# Altium project controle de luminosidade com ESP32.PrjPcb
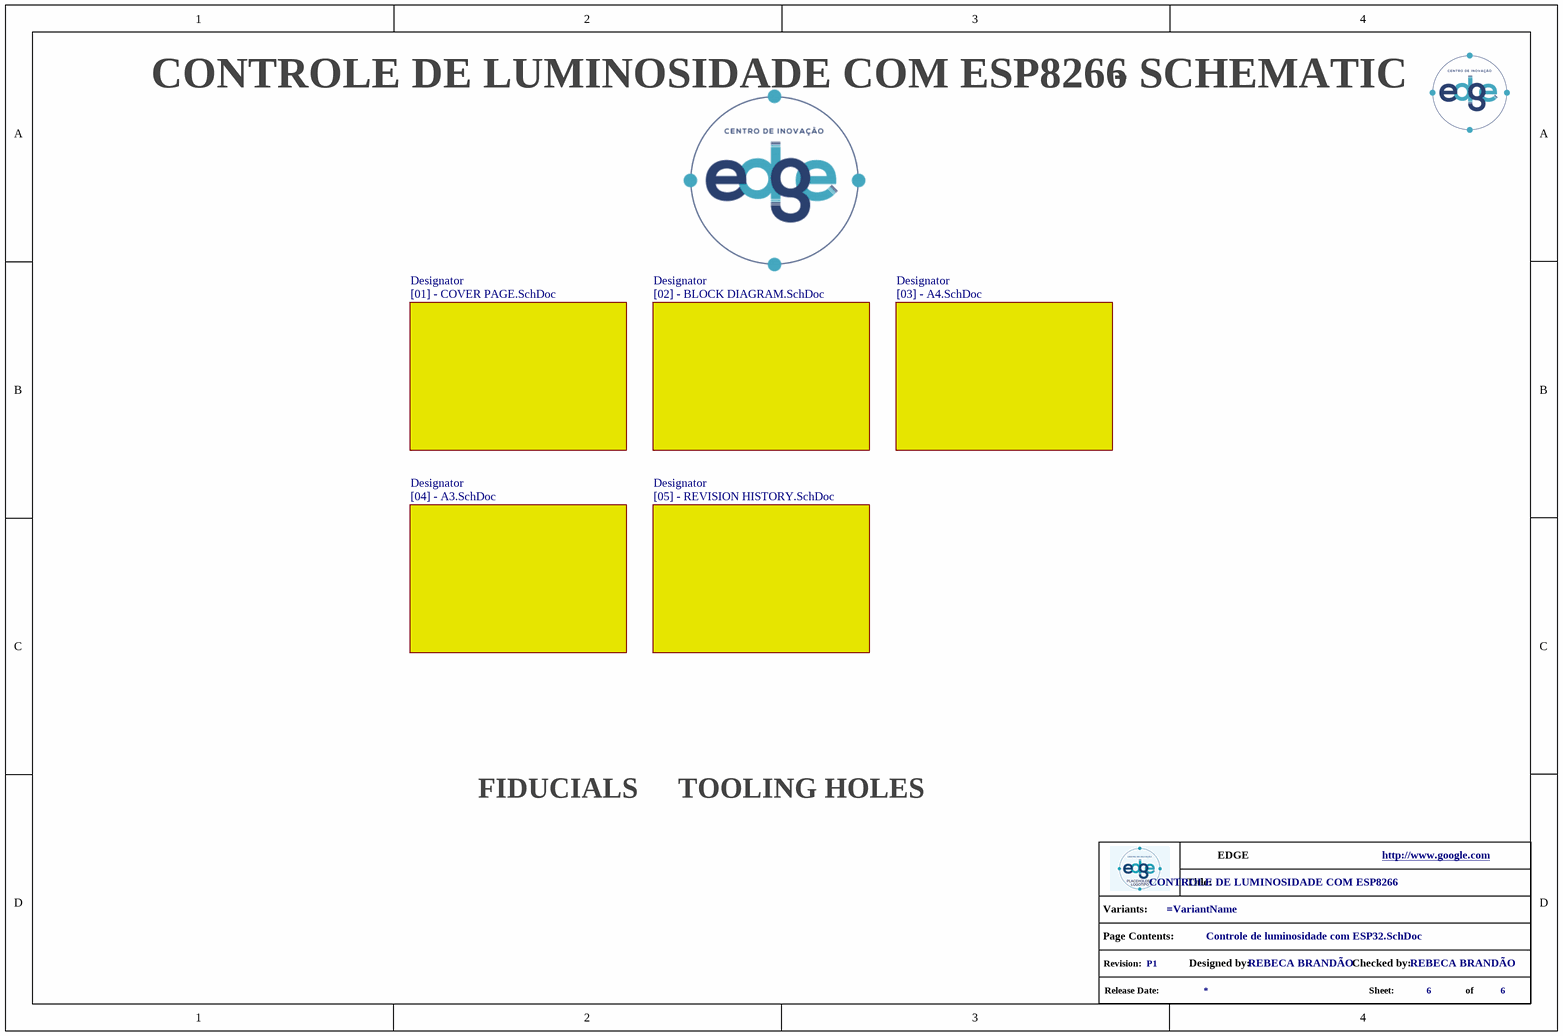
[diagram p0: Controle de luminosidade com ESP32.SchDoc]
CheckedProject: REBECA BRANDÃO; Company: EDGE; DesignedProject: REBECA BRANDÃO; TitleProject: CONTROLE DE LUMINOSIDADE COM ESP8266; VersionRevision: P1; Website: http://www.google.com
5 sheets, 42 parts. Net scope: global (net labels, ports and power ports of the same name join across sheets).
Board file: controle de luminosidade com ESP32.PcbDoc
Sheets:
  Controle de luminosidade com ESP32.SchDoc
    Designator = [02] - BLOCK DIAGRAM.SchDoc
    Designator = [03] - A4.SchDoc
    Designator = [04] - A3.SchDoc
    Designator = [05] - REVISION HISTORY.SchDoc

## Sheet Controle de luminosidade com ESP32.SchDoc
size A4; DocumentNumber: 6; SheetNumber: 6; SheetTotal: 6

### Parts
(Parts that share a designator on the sheet are numbered #1, #2 ... from top to bottom, then left to right.)
*?#1  info_project  (value not drawn)  (graphical)

### Sub-sheets
Designator = [02] - BLOCK DIAGRAM.SchDoc: no entries
Designator = [03] - A4.SchDoc: no entries
Designator = [01] - COVER PAGE.SchDoc (file not in this document): no entries
Designator = [04] - A3.SchDoc: no entries
Designator = [05] - REVISION HISTORY.SchDoc: no entries

### Notes on the sheet
- - SCHEMATIC
- FIDUCIALS
- TOOLING HOLES
- (in symbol info_project) Title:; Variants:; Page Contents:; Revision:; Designed by:; Checked by:; Release Date:; Sheet:; of

## Sheet [02] - BLOCK DIAGRAM.SchDoc
size A2; DocumentNumber: 2; SheetNumber: 2; SheetTotal: 6; PageSetup: Record=PageOptions|CenterHorizontal=True|CenterVertical=True|PrintScale=0.52|XCorrection=1.00|YCorrection=1.00|PrintKind=1|BorderSize=5000000|LeftOffset=0|BottomOffset=0|Orientation=2|PaperLength=1000|PaperWidth=1000|Scale=100|PaperSource=4|PrintQuality=600|MediaType=1|DitherType=10|PrintScaleMode=1|PaperKind=A4|PaperIndex=9
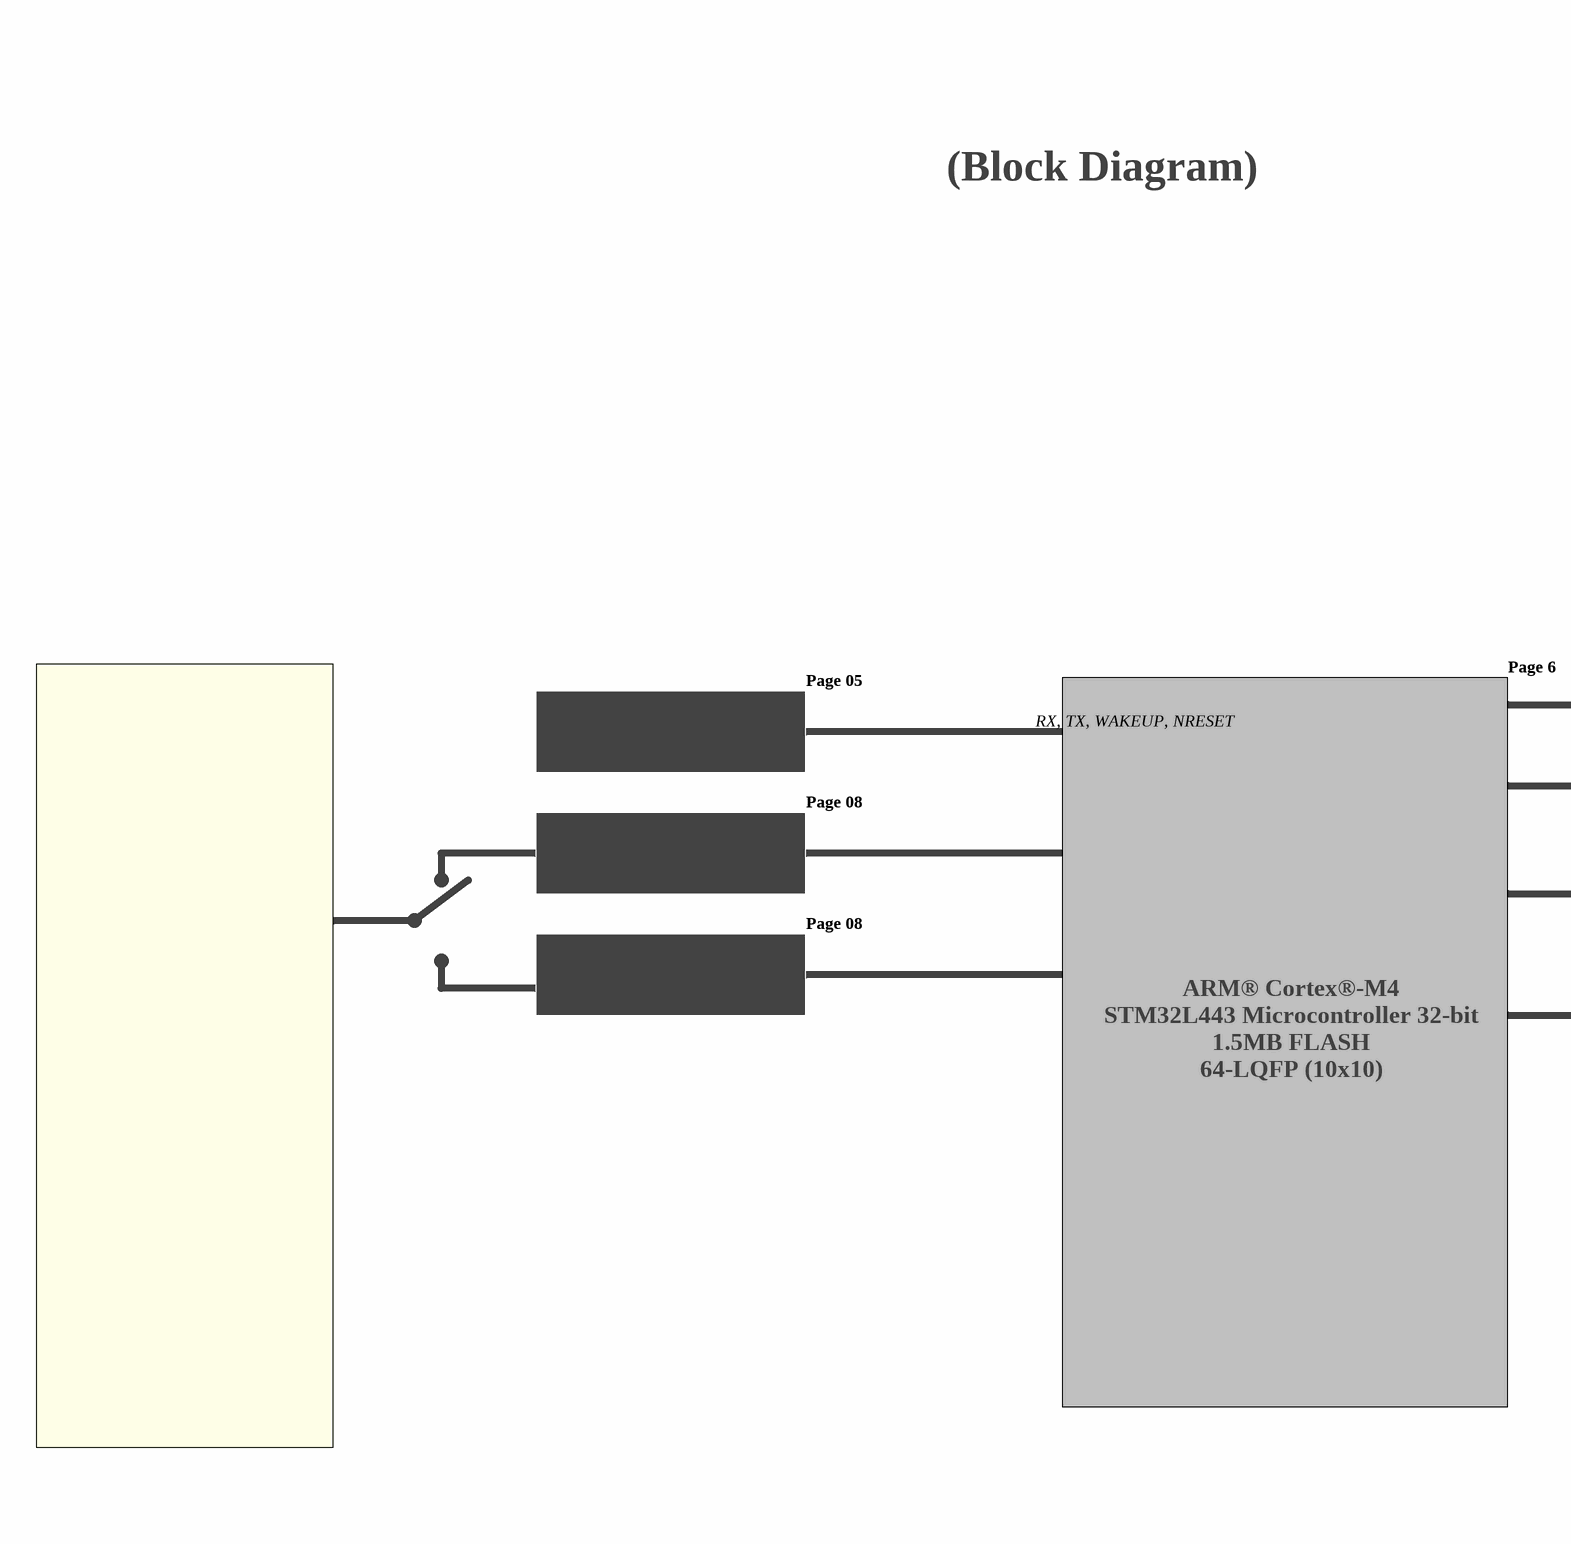
[diagram p1: [02] - BLOCK DIAGRAM.SchDoc, left]
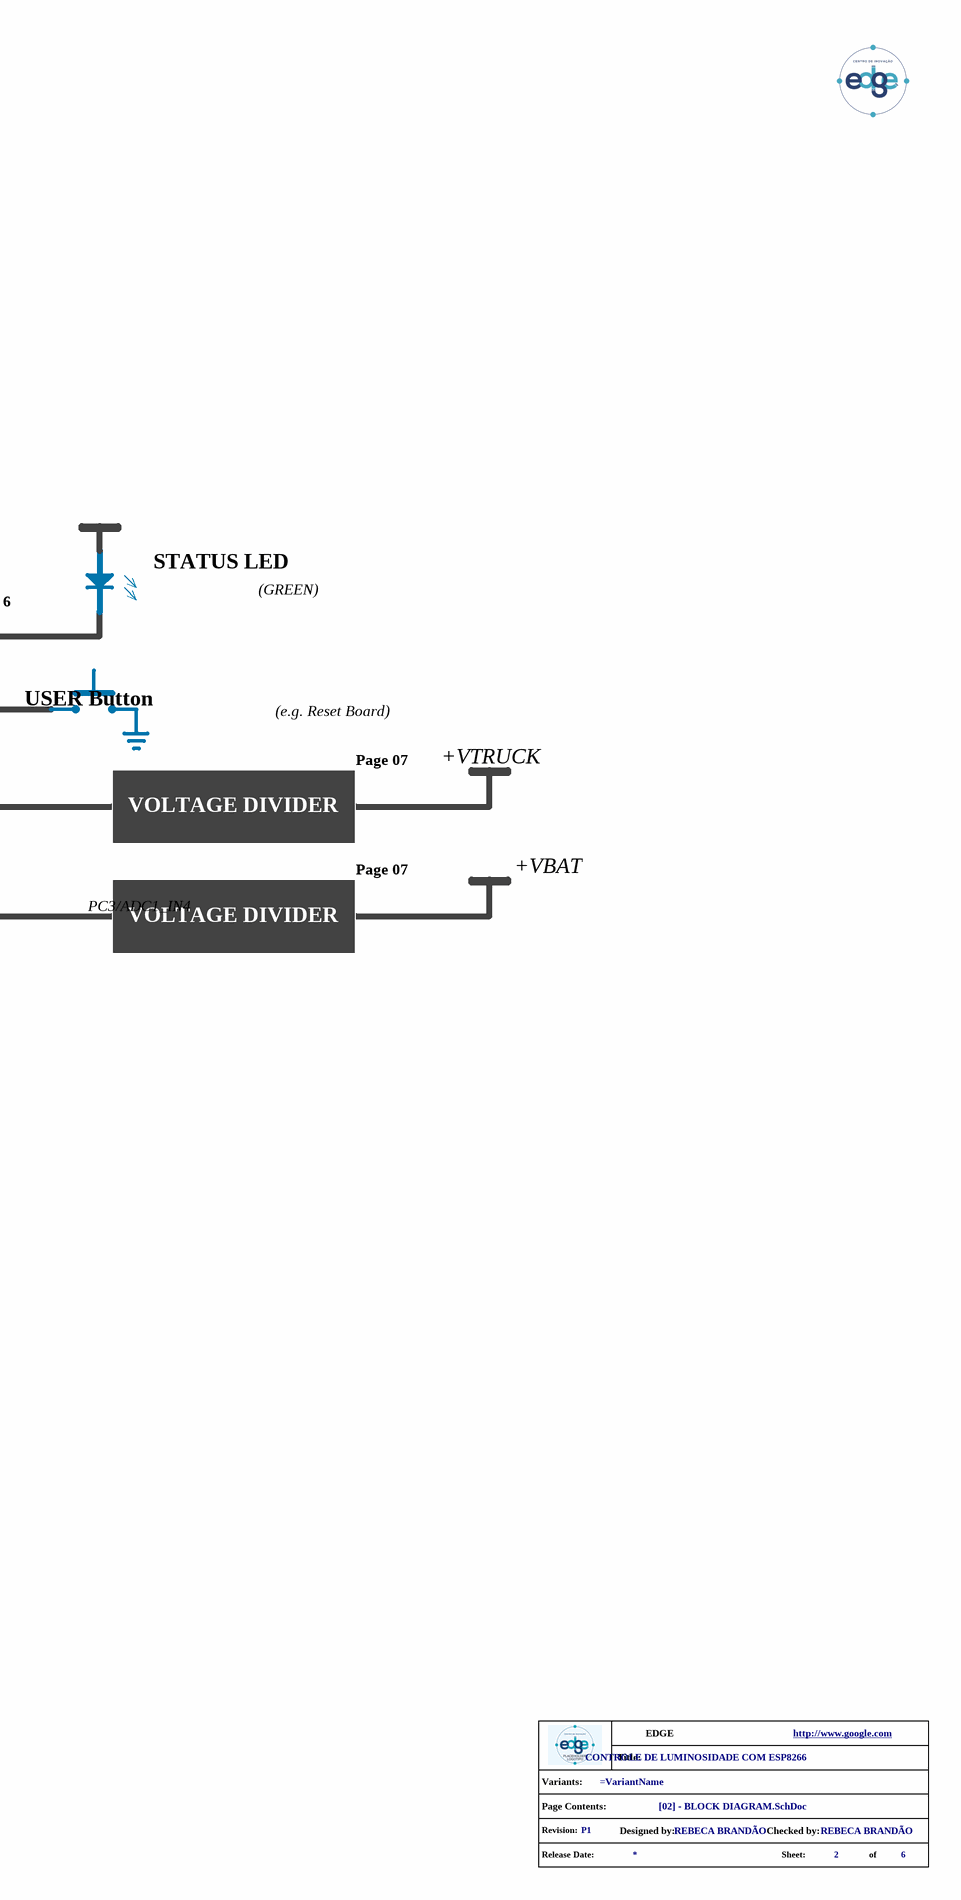
[diagram p2: [02] - BLOCK DIAGRAM.SchDoc, right]

### Parts
(Parts that share a designator on the sheet are numbered #1, #2 ... from top to bottom, then left to right.)
*?#2  info_project  (value not drawn)  (graphical)

### Notes on the sheet
- (Block Diagram)
- STATUS LED
- Page 05
- Page 6
- (GREEN)
- RX, TX, WAKEUP, NRESET
- USER Button
- Page 08
- (e.g. Reset Board)
- Page 07
- +VTRUCK
- VOLTAGE DIVIDER
- ARM® Cortex®-M4
- +VBAT
- STM32L443 Microcontroller 32-bit
- 1.5MB FLASH
- PC3/ADC1_IN4
- 64-LQFP (10x10)
- (in symbol info_project) Title:; Variants:; Page Contents:; Revision:; Designed by:; Checked by:; Release Date:; Sheet:; of

## Sheet [03] - A4.SchDoc
size A4; DocumentNumber: 3; SheetNumber: 3; SheetTotal: 6
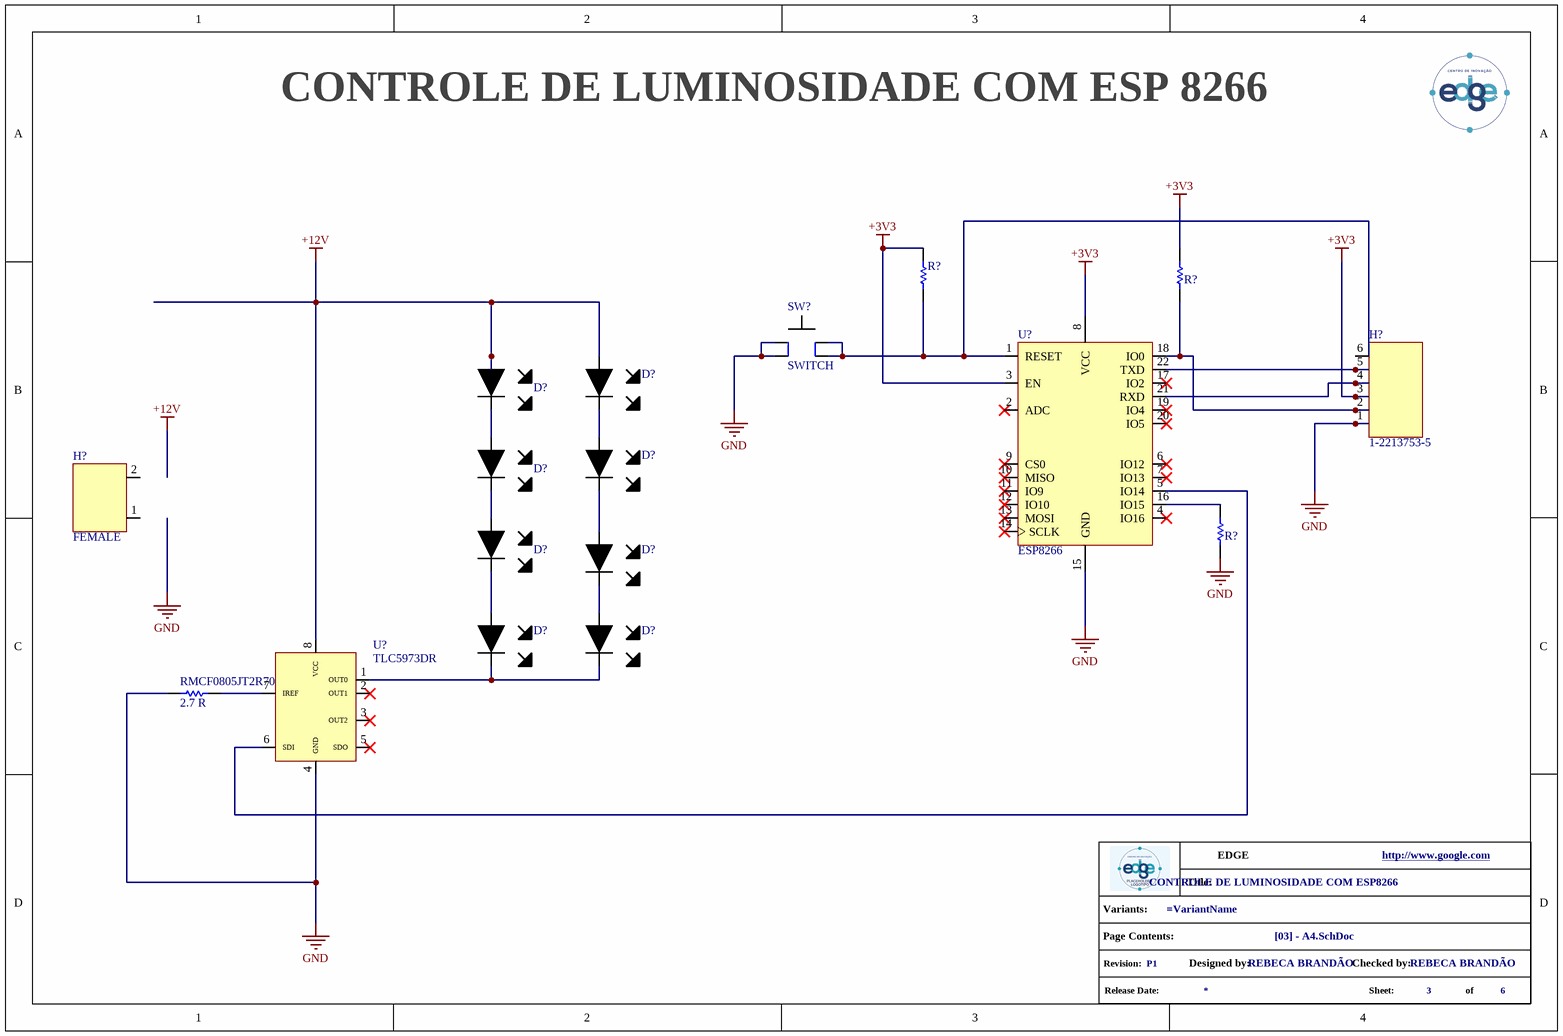
[diagram p3: [03] - A4.SchDoc]

### Parts
(Parts that share a designator on the sheet are numbered #1, #2 ... from top to bottom, then left to right.)
*?#3  info_project  (value not drawn)  (graphical)
D?#1  WHITE_LED  [WHITE_LED]  (value not drawn)
D?#2  WHITE_LED  [WHITE_LED]  (value not drawn)
D?#3  WHITE_LED  [WHITE_LED]  (value not drawn)
D?#4  WHITE_LED  [WHITE_LED]  (value not drawn)
D?#5  WHITE_LED  [WHITE_LED]  (value not drawn)
D?#6  WHITE_LED  [WHITE_LED]  (value not drawn)
D?#7  WHITE_LED  [WHITE_LED]  (value not drawn)
D?#8  WHITE_LED  [WHITE_LED]  (value not drawn)
H?#1  1-2213753-5
H?#2  FEMALE
R?#1  RESISTOR CFR-25JB-52-4K7  [R0805]  (value not drawn)
R?#2  CFR-25JB-52-10K  [R0603]  (value not drawn)
R?#3  CFR-25JB-52-10K  [R0603]  (value not drawn)
RMCF0805JT2R70  2.7 R  [R0805]
SW?#1  SWITCH
U?#1  ESP8266  [XCVR_ESP8266-12E/ESP-12E]
U?#2  TLC5973DR  [TLC5973]

### Nets
+3V3: H?#1.3 R?#1.2 R?#2.2 U?#1.3(EN) U?#1.8(VCC)
+12V: D?#1.1 D?#2.1 U?#2.8(VCC)
GND: H?#1.1 R?#3.1 RMCF0805JT2R70.1 SW?#1.SW1 U?#1.15(GND) U?#2.4(GND)
NetD?#1_2: D?#1.2 D?#3.1
NetD?#2_2: D?#2.2 D?#4.1
NetD?#3_2: D?#3.2 D?#5.1
NetD?#4_2: D?#4.2 D?#6.1
NetD?#5_2: D?#5.2 D?#7.1
NetD?#6_2: D?#6.2 D?#8.1
NetD?#7_2: D?#7.2 D?#8.2 U?#2.1(OUT0)
NetH?#1_2: H?#1.2 R?#2.1 U?#1.18(IO0)
NetH?#1_4: H?#1.4 U?#1.21(RXD)
NetH?#1_5: H?#1.5 U?#1.22(TXD)
NetR?#1_1: R?#1.1 SW?#1.SW1 U?#1.1(RESET)
NetR?#3_2: R?#3.2 U?#1.16(IO15)
NetRMCF0805JT2R70_2: RMCF0805JT2R70.2 U?#2.7(IREF)
NetU?#1_5: U?#1.5(IO14) U?#2.6(SDI)

Not connected (* = marked no-connect by the designer): H?#1 6; H?#2 1(__1) 2(_2); U?#1 2(ADC)* 4(IO16)* 6(IO12)* 7(IO13)* 9(CS0)* 10(MISO)* 11(IO9)* 12(IO10)* 13(MOSI)* 14(SCLK)* 17(IO2)* 19(IO4)* 20(IO5)*; U?#2 2(OUT1)* 3(OUT2)* 5(SDO)*

### Notes on the sheet
- CONTROLE DE LUMINOSIDADE COM ESP 8266
- (in symbol info_project) Title:; Variants:; Page Contents:; Revision:; Designed by:; Checked by:; Release Date:; Sheet:; of

### Library data of the parts
D?#1-D?#8 = WHITE_LED: LED - WHITE CLEAR T-1 3/4 T/H; Supplier 1: Digi-Key; Supplier Part Number 1: 492-2209-1-ND
H?#1 = 1-2213753-5: CONN - HEADER 6 pins; Manufacturer 1: TE Connectivity; Supplier 1: Mouser; Manufacturer Part Number 1: 1-2213753-5; Stock 1: 2922; Pricing 1: 1=1.55000, 10=1.27000, 50=1.27000, 100=1.09000, 1000=0.86200, 10000=0.74800 (USD); RoHS: Yes; RoHS Compliant: Yes; Supplier Part Number 1: 571-1-2213753-5; .SCHChecked: *
H?#2 = Alimentação: .SCHChecked: *
R?#1 = CFR-25JB-52-4K7: RES - 4.7K OHM 1/4W 5% AXIAL
R?#2 = CFR-25JB-52-10K: RES - 10K OHM 1/4W 5% AXIAL; Supplier 1: Digi-Key; Supplier Part Number 1: 10KQBK-ND
R?#3 = CFR-25JB-52-10K (1): RES 10K OHM 1/4W 5% AXIAL; Supplier 1: Digi-Key; Supplier Part Number 1: 10KQBK-ND
RMCF0805JT2R70 = RMCF0805JT2R70: RES -  2.7 OHM 1/8W 5% 0805; Manufacturer 1: Stackpole Electronics; Resistance: 2.7R; Max Power Dissipation: 125mW; Temperature Coefficient: 200ppm/°C; Supplier 1: Digi-Key; Supplier Part Number 1: 738-RMCF0805JT2R70CT-ND; Manufacturer Part Number 1: RMCF0805JT2R70; Stock 1: 439; Pricing 1: 1=0.10000, 10=0.02000, 100=0.00810, 1000=0.00366, 2500=0.00318 (USD); RoHS: Yes; Mount: Surface Mount; Case/Package: 0805; Case Code (Metric): 2012; Case Code (Imperial): 0805; Contact Plating: Tin,Matte; Min Operating Temperature: -55°C; Max Operating Temperature: 155°C; Packaging: Tape and Reel; Tolerance: 5%; Resistor Type: Thick Film; Number of Terminations: 2; Features: Automotive AEC-Q200; Series: RMCF; Length: 0.079inch; Width: 0.049inch; Height: 0.026inch; Radiation Hardening: No; RoHS Compliant: Yes; ComponentLink1URL: http://components.arrow.com/part/dataview/50862679S7247335N1174?src-supplier=Arrow+Electronics; ComponentLink1Description: http://components.arrow.com/part/dataview/50862679S7247335N1174?src-supplier=Arrow+Electronics; ComponentLink2URL: https://www.seielect.com/catalog/sei-rmcf_rmcp.pdf?src-supplier=Digi-Key; ComponentLink2Description: https://www.seielect.com/catalog/sei-rmcf_rmcp.pdf?src-supplier=Digi-Key; ComponentLink3URL: https://www.seielect.com/catalog/SEI-Packaging.pdf?src-supplier=Digi-Key; ComponentLink3Description: https://www.seielect.com/catalog/SEI-Packaging.pdf?src-supplier=Digi-Key; ComponentLink4URL: https://www.seielect.com/catalog/SEI-RMCF_RMCP.pdf?src-supplier=Avnet; ComponentLink4Description: https://www.seielect.com/catalog/SEI-RMCF_RMCP.pdf?src-supplier=Avnet; .SCHChecked: *
SW?#1 = switch: SWITCH - 4 PINS
U?#1 = ESP8266: IC - ESP8266 SMT Module / WiFi 802.11b/g/n Transceiver Module 2.4GHz ~ 2.5GHz Integrated, Trace Surface Mount; Supplier 1: Digi-Key; Supplier Part Number 1: 1528-1438-ND
U?#2 = TLC5973DR: IC - TLC5973DR LED Lighting Drivers 3Ch 12B PWM Constant Crnt LED Dvr; Supplier 1: Mouser; Supplier Part Number 1: 595-TLC5973DR

## Sheet [04] - A3.SchDoc
size A3; DocumentNumber: 4; SheetNumber: 4; SheetTotal: 6
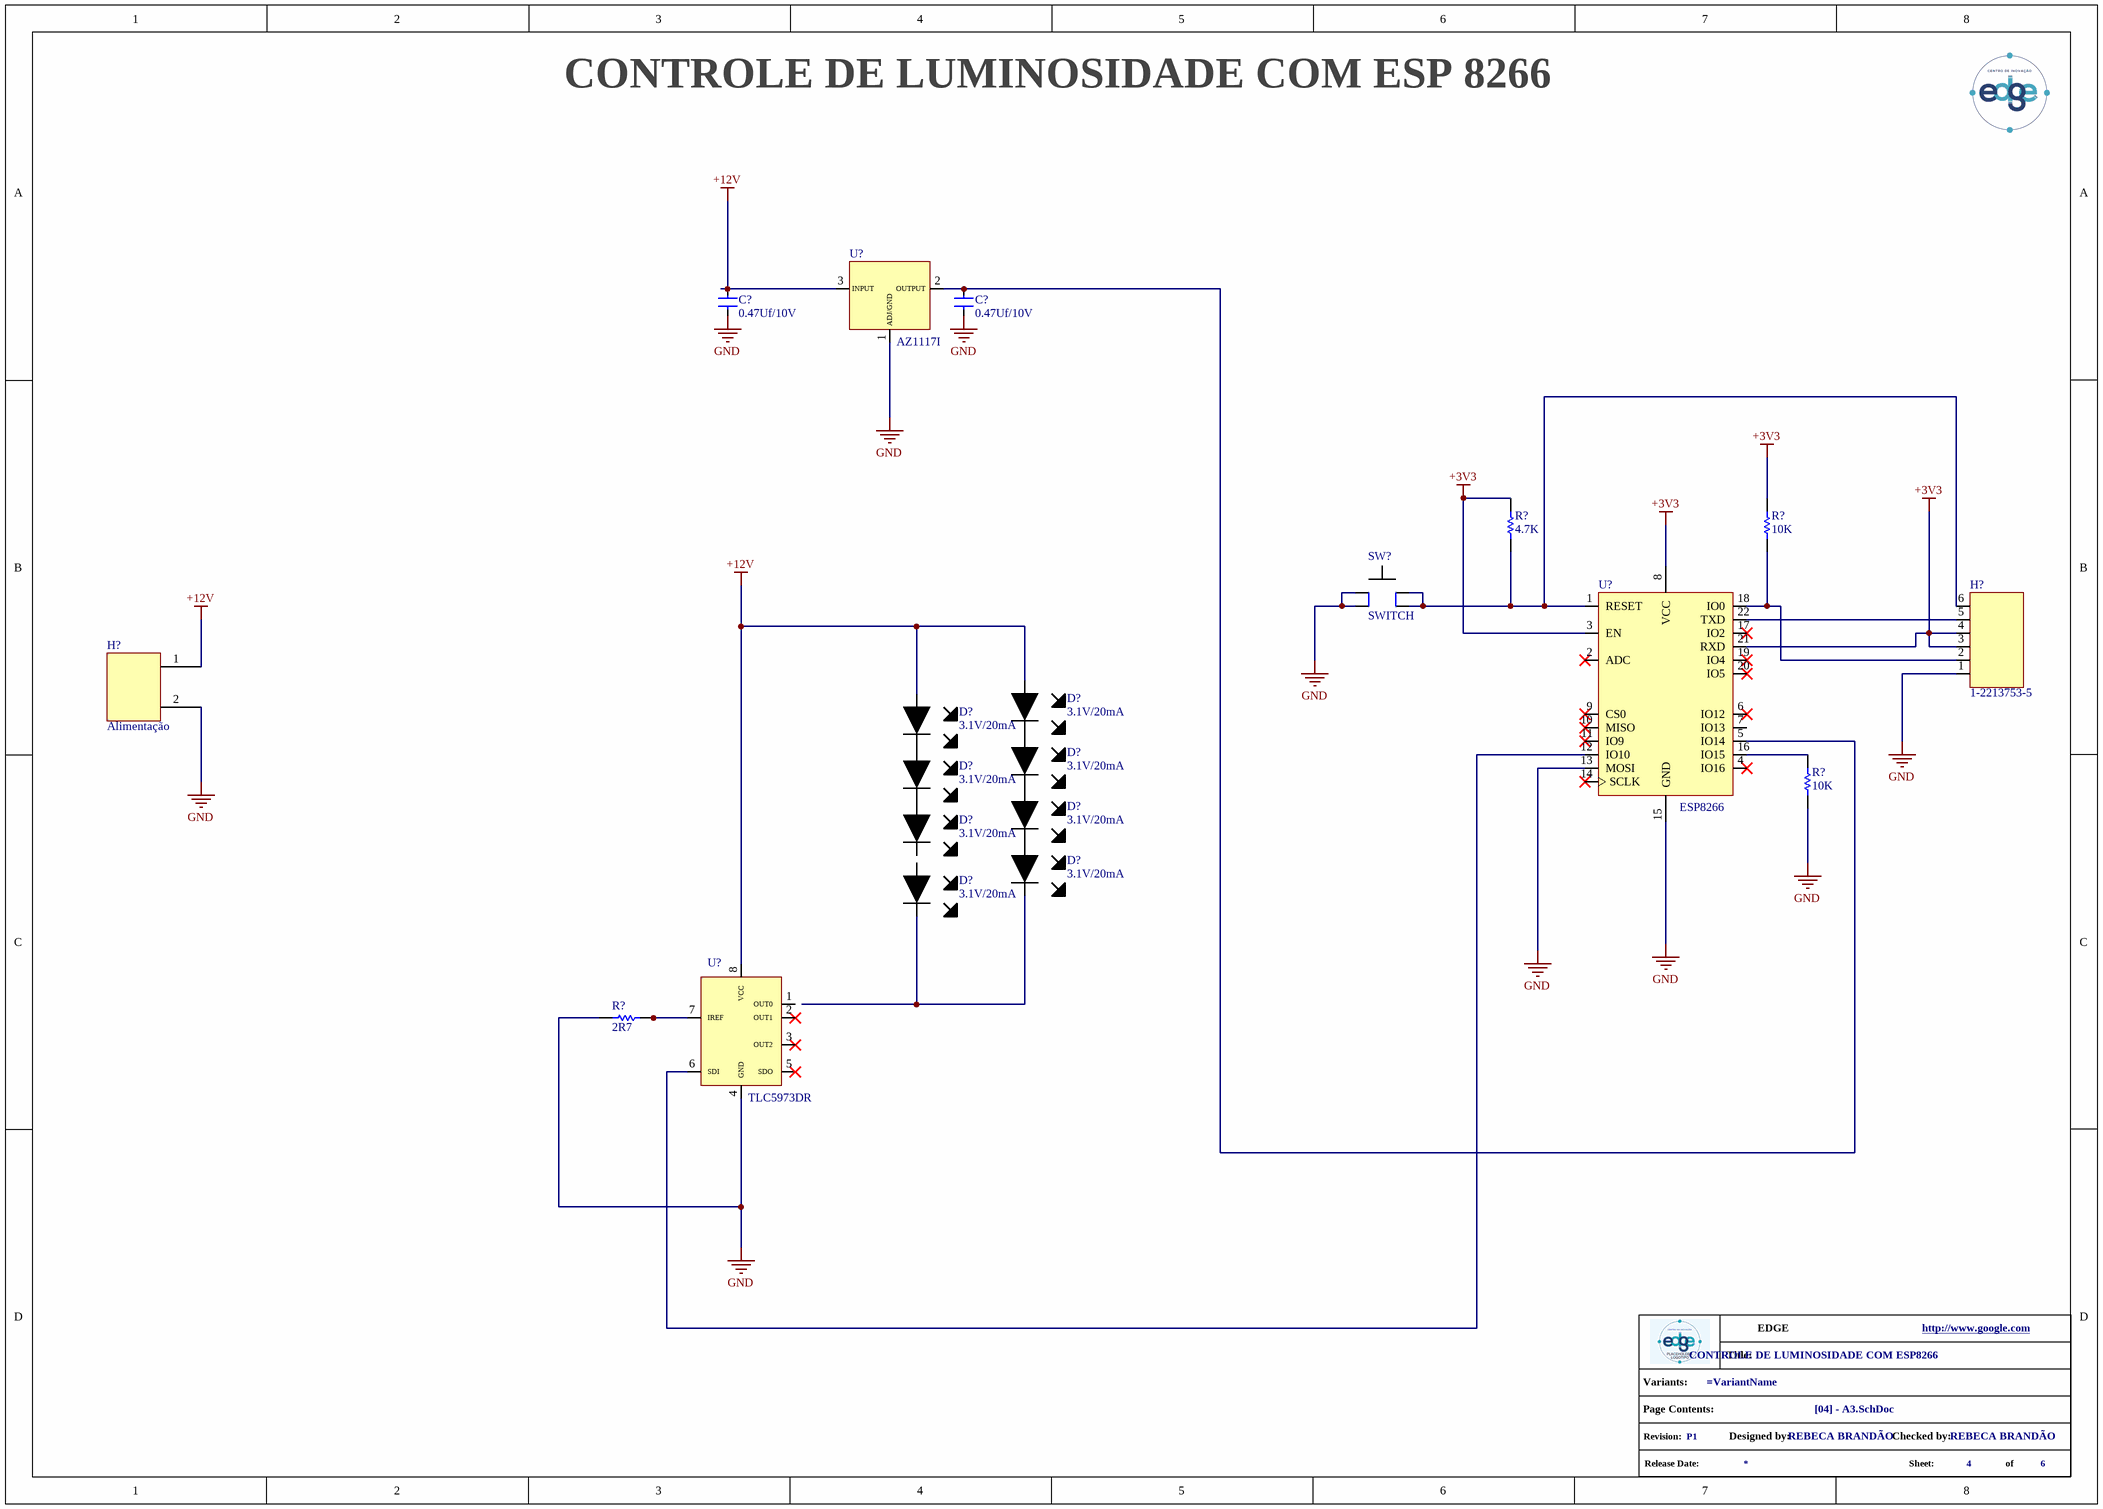
[diagram p4: [04] - A3.SchDoc]

### Parts
(Parts that share a designator on the sheet are numbered #1, #2 ... from top to bottom, then left to right.)
*?#4  info_project  (value not drawn)  (graphical)
C?#1  0.47Uf/10V  [C0402]
C?#2  0.47Uf/10V  [C0402]
D?#9  3.1V/20mA  [WHITE_LED]
D?#10  3.1V/20mA  [WHITE_LED]
D?#11  3.1V/20mA  [WHITE_LED]
D?#12  3.1V/20mA  [WHITE_LED]
D?#13  3.1V/20mA  [WHITE_LED]
D?#14  3.1V/20mA  [WHITE_LED]
D?#15  3.1V/20mA  [WHITE_LED]
D?#16  3.1V/20mA  [WHITE_LED]
H?#3  1-2213753-5
H?#4  Alimentação
R?#4  4.7K  [R0402]
R?#5  10K  [C0603]
R?#6  10K  [C0603]
R?#7  2R7  [R0805]
SW?#2  SWITCH
U?#3  AZ1117I  [SOT230P700X170-4N]
U?#4  ESP8266  [XCVR_ESP8266-12E/ESP-12E]
U?#5  TLC5973DR  [TLC5973]

### Nets
+3V3: H?#3.3 H?#3.4 R?#4.2 R?#5.2 U?#4.3(EN) U?#4.8(VCC) U?#4.21(RXD)
+12V: C?#1.1 D?#9.1 D?#10.1 H?#4.1 U?#3.3(INPUT) U?#5.8(VCC)
GND: C?#1.2 C?#2.1 H?#3.1 H?#4.2 R?#6.1 R?#7.1 SW?#2.SW1 U?#3.1(ADJ/GND) U?#4.13(MOSI) U?#4.15(GND) U?#5.4(GND)
NetC?#2_2: C?#2.2 U?#3.2(OUTPUT) U?#4.5(IO14)
NetD?#9_2: D?#9.2 D?#11.1
NetD?#10_2: D?#10.2 D?#12.1
NetD?#11_2: D?#11.2 D?#13.1
NetD?#12_2: D?#12.2 D?#14.1
NetD?#13_2: D?#13.2 D?#15.1
NetD?#15_2: D?#15.2 D?#16.2
NetH?#3_2: H?#3.2 R?#5.1 U?#4.18(IO0)
NetH?#3_5: H?#3.5 U?#4.22(TXD)
NetH?#3_6: H?#3.6 R?#4.1 SW?#2.SW1 U?#4.1(RESET)
NetR?#6_2: R?#6.2 U?#4.16(IO15)
NetR?#7_2: R?#7.2 U?#5.7(IREF)
NetU?#4_12: U?#4.12(IO10) U?#5.6(SDI)

Not connected (* = marked no-connect by the designer): D?#14 2; D?#16 1; U?#4 2(ADC)* 4(IO16)* 6(IO12)* 7(IO13) 9(CS0)* 10(MISO)* 11(IO9)* 14(SCLK)* 17(IO2)* 19(IO4)* 20(IO5)*; U?#5 1(OUT0) 2(OUT1)* 3(OUT2)* 5(SDO)*

### Notes on the sheet
- CONTROLE DE LUMINOSIDADE COM ESP 8266
- (in symbol info_project) Title:; Variants:; Page Contents:; Revision:; Designed by:; Checked by:; Release Date:; Sheet:; of

### Library data of the parts
C?#1 C?#2 = CC0402KRX5R6BB474: MLCC- CAP CER 0.47UF 10V X5R 0402; Supplier 1: Digi-Key; Supplier Part Number 1: 1276-1173-1-ND
D?#9-D?#16 = SM0402UWC: LED -  LED WHITE DIFFUSED 0402 SMD; Supplier 1: Digi-Key; Supplier Part Number 1: 492-2209-1-ND; .PCBChecked: *; .SCHChecked: *
H?#3 = 1-2213753-5: CONN-Headers  6 POS HIGH TEMP MATE-N-LOK SKT ASSM; Manufacturer 1: TE Connectivity; Supplier 1: Mouser; Manufacturer Part Number 1: 1-2213753-5; Stock 1: 2922; Pricing 1: 1=1.55000, 10=1.27000, 50=1.27000, 100=1.09000, 1000=0.86200, 10000=0.74800 (USD); RoHS: Yes; RoHS Compliant: Yes; Supplier Part Number 1: 571-1-2213753-5
R?#4 = CFR-25JB-52-4K7 _1: RES 4.7K OHM 1/4W 5% AXIAL; Manufacturer 1: Yageo; Resistance: 4.7kR; Power Rating: 250mW; Temperature Coefficient: 500ppm/°C; Supplier 1: Digi-Key; Manufacturer Part Number 1: CFR-25JB-52-4K7; Stock 1: 122217; Pricing 1: 1=0.10000, 10=0.06700, 25=0.04640, 50=0.03600, 100=0.02580, 250=0.02008, 500=0.01596, 1000=0.01133, 5000=0.00876 (USD); RoHS: Yes; Case/Package: Axial; Min Operating Temperature: -55°C; Max Operating Temperature: 155°C; Tolerance: 5%; Package Quantity: 200; Packaging: Bulk; Resistor Type: Carbon Film; Number of Terminations: 2; Max Power Dissipation: 250mW; Series: Carbon Film; Length: 0.248inch; Lead Free: Lead Free; RoHS Compliant: Yes; ComponentLink1URL: http://www.yageo.com/NewPortal/yageodocoutput?fileName=/pdf/throughhole/Yageo_LR_CFR_2013.pdf&src-supplier=Digi-Key; ComponentLink1Description: http://www.yageo.com/NewPortal/yageodocoutput?fileName=/pdf/throughhole/Yageo_LR_CFR_2013.pdf&src-supplier=Digi-Key; ComponentLink2URL: http://www.yageo.com/documents/recent/General%20Type_CFR.pdf?src-supplier=Future+Electronics; ComponentLink2Description: http://www.yageo.com/documents/recent/General%20Type_CFR.pdf?src-supplier=Future+Electronics; Supplier Part Number 1: 4.7KQBK-ND
R?#5 R?#6 = CFR-25JB-52-10K: RES 10K OHM 1/4W 5% AXIAL; Manufacturer 1: Yageo; Resistance: 10kR; Temperature Coefficient: 500ppm/°C; Max Power Dissipation: 250mW; Supplier 1: Digi-Key; Manufacturer Part Number 1: CFR-25JB-52-10K; Stock 1: 275987; Pricing 1: 1=0.10000, 10=0.06700, 25=0.04640, 50=0.03600, 100=0.02580, 250=0.02008, 500=0.01596, 1000=0.01133, 5000=0.00876 (USD); RoHS: Yes; Case/Package: Axial; Min Operating Temperature: -55°C; Max Operating Temperature: 155°C; Package Quantity: 200; Packaging: Bulk; Tolerance: 5%; Resistor Type: Carbon Film; Number of Terminations: 2; Series: Carbon Film; Length: 0.248inch; RoHS Compliant: Yes; Lead Free: Lead Free; ComponentLink1URL: http://components.arrow.com/part/dataview/0323_07021247?src-supplier=Arrow+Europe; ComponentLink1Description: http://components.arrow.com/part/dataview/0323_07021247?src-supplier=Arrow+Europe; ComponentLink2URL: http://www.yageo.com/NewPortal/yageodocoutput?fileName=/pdf/throughhole/Yageo_LR_CFR_2013.pdf&src-supplier=Digi-Key; ComponentLink2Description: http://www.yageo.com/NewPortal/yageodocoutput?fileName=/pdf/throughhole/Yageo_LR_CFR_2013.pdf&src-supplier=Digi-Key; Supplier Part Number 1: 10KQBK-ND
R?#7 = RMCF0805JT2R70: as RMCF0805JT2R70 on sheet [03] - A4; Supplier 1: Digi-Key; Manufacturer Part Number 1: RMCF0805JT2R70; Stock 1: 439; Pricing 1: 1=0.10000, 10=0.02000, 100=0.00810, 1000=0.00366, 2500=0.00318 (USD); RoHS: Yes; Mount: Surface Mount; Case/Package: 0805; Case Code (Metric): 2012; Case Code (Imperial): 0805; Contact Plating: Tin,Matte; Min Operating Temperature: -55°C; Max Operating Temperature: 155°C; Packaging: Tape and Reel; Tolerance: 5%; Resistor Type: Thick Film; Number of Terminations: 2; Features: Automotive AEC-Q200; Series: RMCF; Length: 0.079inch; Width: 0.049inch; Height: 0.026inch; Radiation Hardening: No; RoHS Compliant: Yes; ComponentLink1URL: http://components.arrow.com/part/dataview/50862679S7247335N1174?src-supplier=Arrow+Electronics; ComponentLink1Description: http://components.arrow.com/part/dataview/50862679S7247335N1174?src-supplier=Arrow+Electronics; ComponentLink2URL: https://www.seielect.com/catalog/sei-rmcf_rmcp.pdf?src-supplier=Digi-Key; ComponentLink2Description: https://www.seielect.com/catalog/sei-rmcf_rmcp.pdf?src-supplier=Digi-Key; ComponentLink3URL: https://www.seielect.com/catalog/SEI-Packaging.pdf?src-supplier=Digi-Key; ComponentLink3Description: https://www.seielect.com/catalog/SEI-Packaging.pdf?src-supplier=Digi-Key; ComponentLink4URL: https://www.seielect.com/catalog/SEI-RMCF_RMCP.pdf?src-supplier=Avnet; ComponentLink4Description: https://www.seielect.com/catalog/SEI-RMCF_RMCP.pdf?src-supplier=Avnet; Supplier Part Number 1: 738-RMCF0805JT2R70CT-ND; .SCHChecked: *
SW?#2 = switch: SWITCH - 4 PINS
U?#3 = AZ1117I: IC - REG LINEAR 3.3V 1A SOT223; Supplier 1: Digi-Key; Supplier Part Number 1: AZ1117IH-3.3TRG1DICT-ND
U?#4 = ESP8266: as U?#1 on sheet [03] - A4; Supplier 1: Digi-Key; Supplier Part Number 1: 1528-1438-ND
U?#5 = TLC5973DR: as U?#2 on sheet [03] - A4; Supplier 1: Mouser; Supplier Part Number 1: 595-TLC5973DR

## Sheet [05] - REVISION HISTORY.SchDoc
size A3; DocumentNumber: 5; SheetNumber: 5; SheetTotal: 6
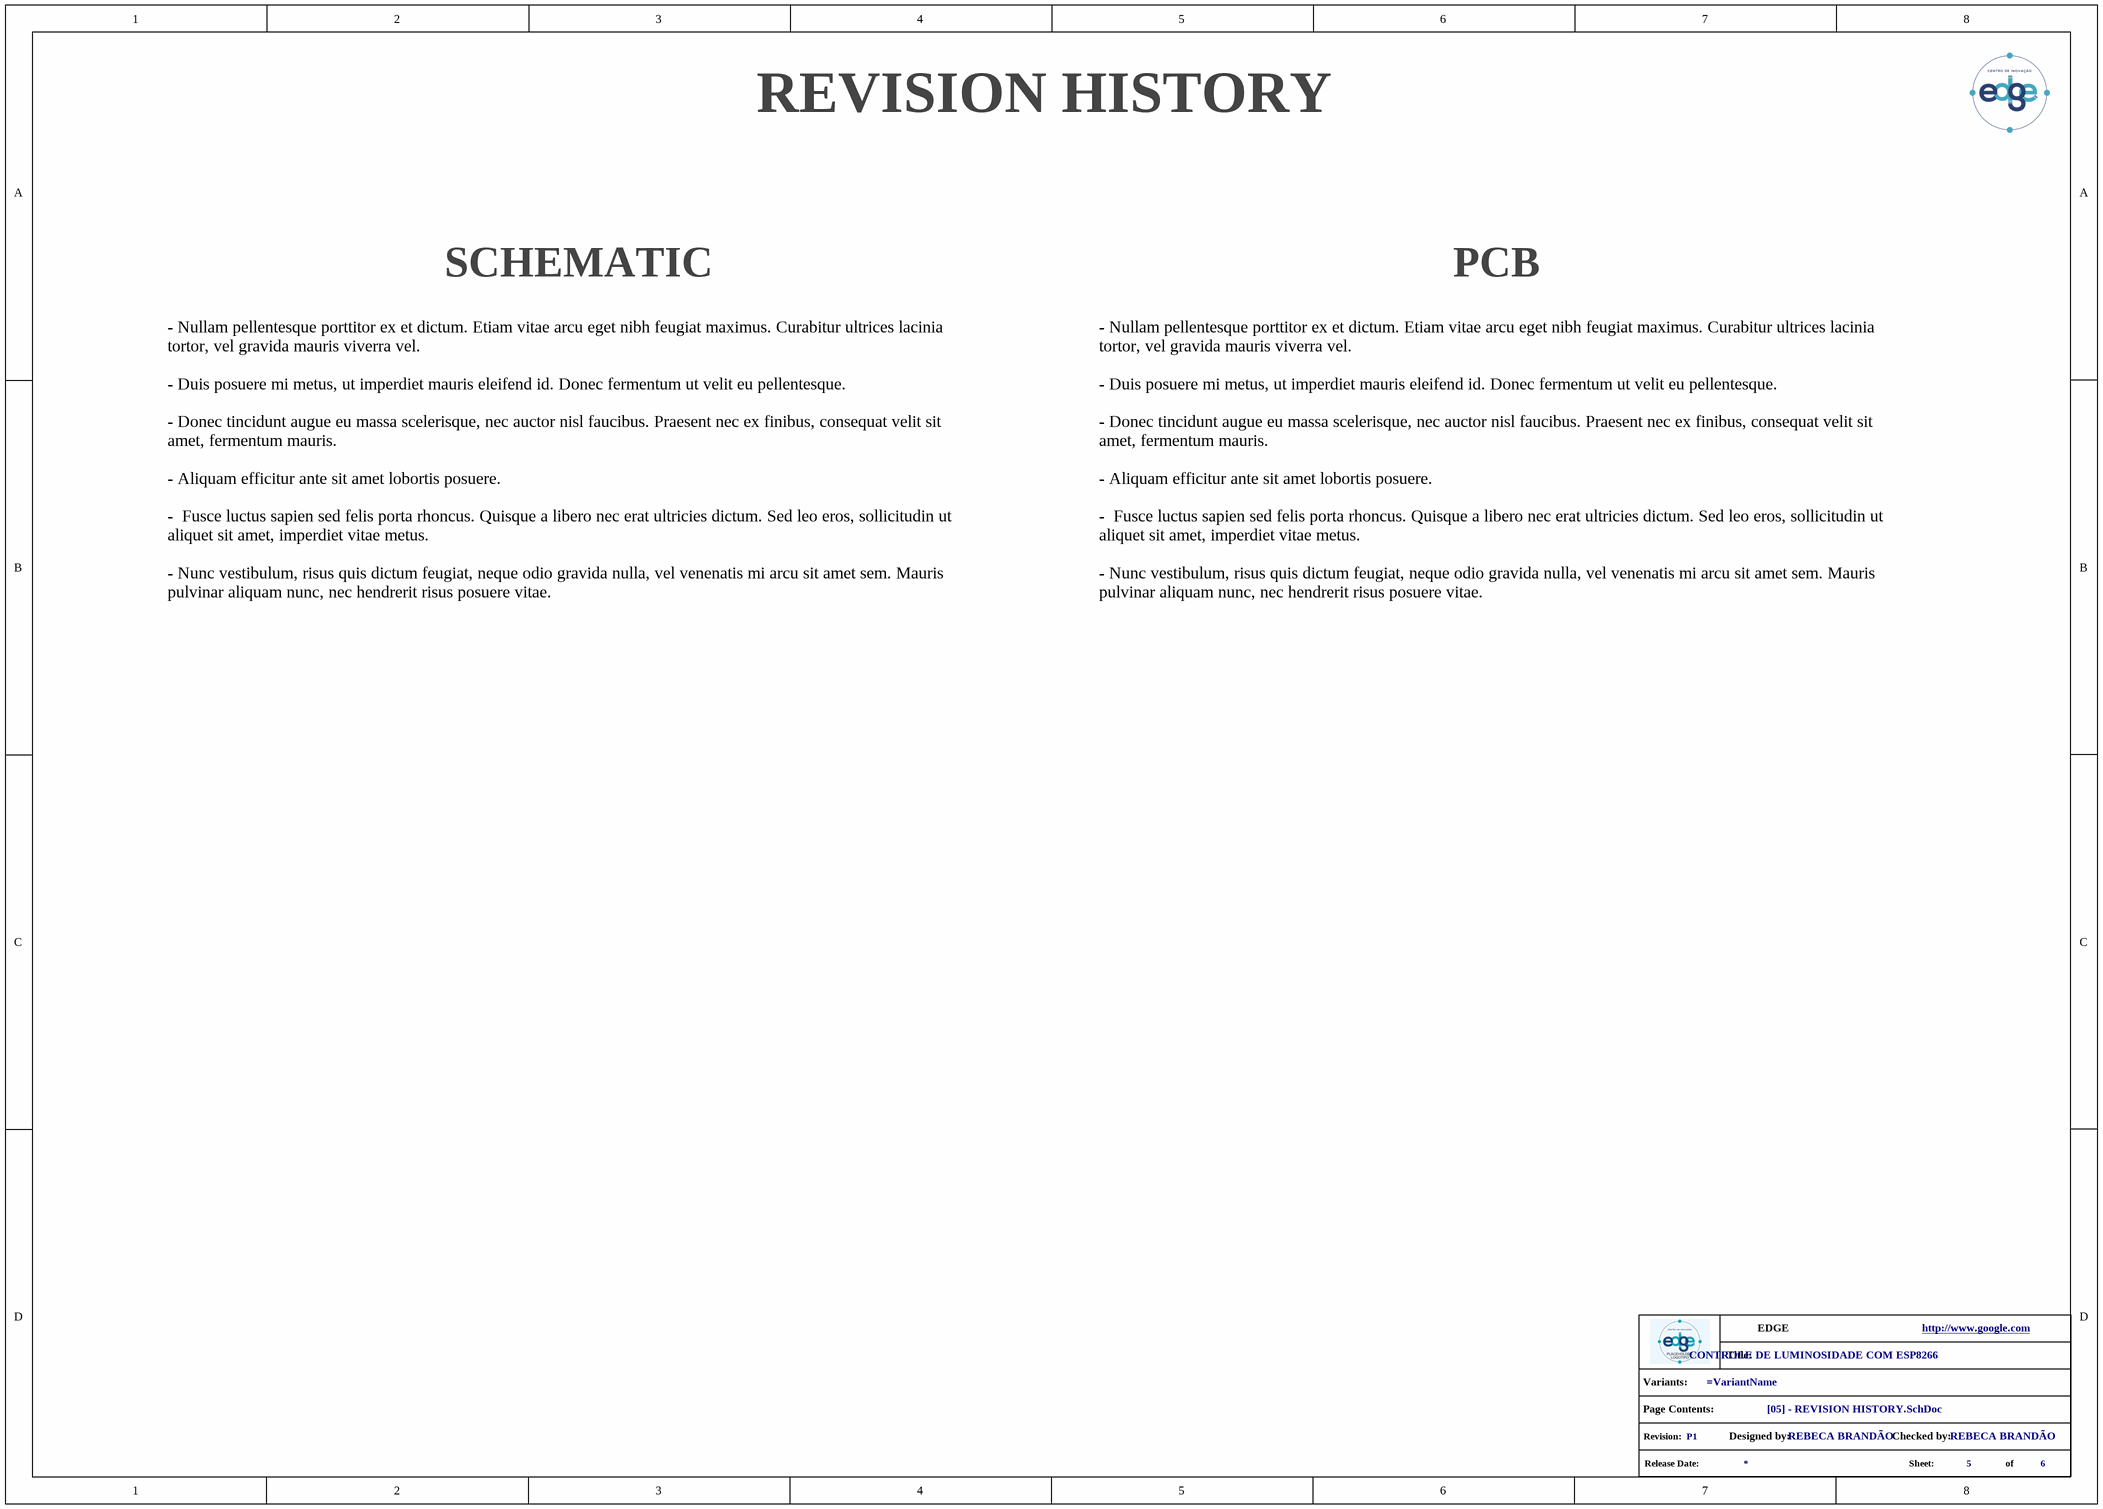
[diagram p5: [05] - REVISION HISTORY.SchDoc]

### Parts
*  info_project  (value not drawn)  (graphical)

### Notes on the sheet
- REVISION HISTORY
- SCHEMATIC
- PCB
- - Nullam pellentesque porttitor ex et dictum. Etiam vitae arcu eget nibh feugiat maximus. Curabitur ultrices lacinia tortor, vel gravida mauris viverra vel.
  - Duis posuere mi metus, ut imperdiet mauris eleifend id. Donec fermentum ut velit eu pellentesque.
  - Donec tincidunt augue eu massa scelerisque, nec auctor nisl faucibus. Praesent nec ex finibus, consequat velit sit amet, fermentum mauris.
  - Aliquam efficitur ante sit amet lobortis posuere.
  -  Fusce luctus sapien sed felis porta rhoncus. Quisque a libero nec erat ultricies dictum. Sed leo eros, sollicitudin ut aliquet sit amet, imperdiet vitae metus.
  - Nunc vestibulum, risus quis dictum feugiat, neque odio gravida nulla, vel venenatis mi arcu sit amet sem. Mauris pulvinar aliquam nunc, nec hendrerit risus posuere vitae.
- (in symbol info_project) Title:; Variants:; Page Contents:; Revision:; Designed by:; Checked by:; Release Date:; Sheet:; of

## Nets that join several sheets
+3V3: [03] - A4 (5 pins), [04] - A3 (7 pins)
+12V: [03] - A4 (D?#1.1 D?#2.1 U?#2.8), [04] - A3 (6 pins)
GND: [03] - A4 (6 pins), [04] - A3 (11 pins)